# EasyEDA Pro project DreamFly.eprj, board PCB3
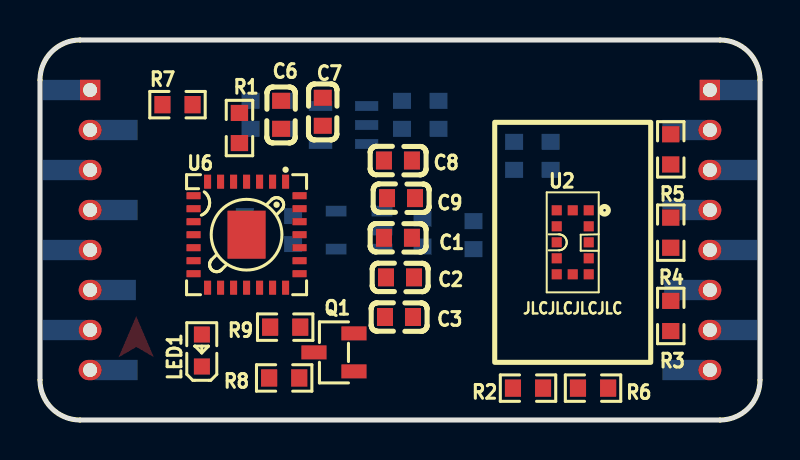
[diagram p8: board, top side]
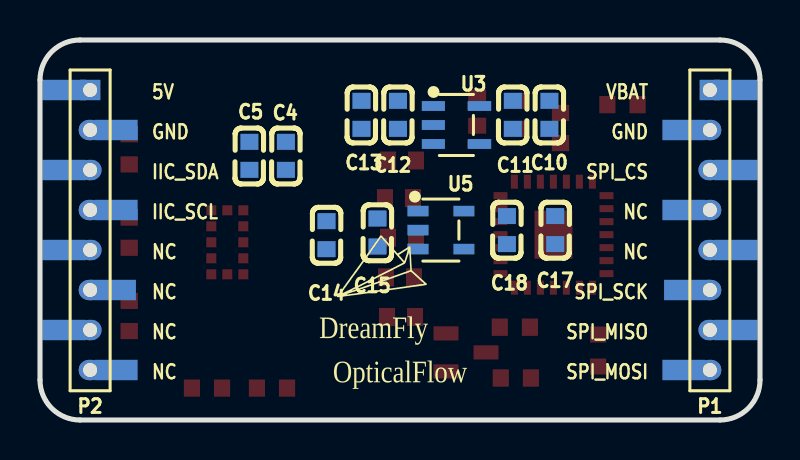
[diagram p9: board, bottom side, seen from below]

Outline 36 x 19 mm; copper layers: Top Layer, Bottom Layer. Coordinates in mm from the lower left corner of the outline.
Outline path: 0,17 0,2 arc(0.59,0.59) 2,0 34,0 arc(35.41,0.59) 36,2 36,17 arc(35.41,18.41) 34,19 2,19 arc(0.59,18.41) 0,17
Stack: Top Layer 0.035mm / Dielectric1 1.51mm FR4 er 4.5 / Bottom Layer 0.035mm

## Design rules (mm)
template: JLCPCB Capability(Two Layers Board)
spacing copperThickness1oz (default): track to track 0.102, other pairs 0.152 to 0.3
spacing copperThickness2oz: track to track 0.203, other pairs 0.152 to 0.3
track width copperThickness1oz (default): min 0.127, default 0.254, max 2.54
track width copperThickness2oz: min 0.203, default 0.254, max 2.54
differential pair differentialPair (default): width min 0.127, default 0.254, max 2.54; gap min 0.152, default 0.152
via viaSize (default): diameter min 0.5, default 0.61, max 10; hole min 0.3, default 0.305, max 6.3

## Placement (name value [footprint] x y rotation side)
C1  10uF  [C0603]  17.9 9.11 180 top
C2  10uF  [C0603]  18 7.13 180 top
C3  100nF  [C0603]  17.95 5.15 180 top
C4  10uF  [C0603]  23.7 13.21 90 bottom
C5  100nF  [C0603]  25.53 13.21 90 bottom
C6  10uF  [C0603]  12.06 15.26 90 top
C7  100nF  [C0603]  14.14 15.41 90 top
C8  10uF  [C0603]  17.9 12.97 180 top
C9  100nF  [C0603]  18.05 11.09 180 top
C10  10uF  [C0603]  10.53 15.26 90 bottom
C11  100nF  [C0603]  12.36 15.26 90 bottom
C12  10uF  [C0603]  18.1 15.26 90 bottom
C13  100nF  [C0603]  19.93 15.26 90 bottom
C14  10uF  [C0603]  21.67 9.24 90 bottom
C15  100nF  [C0603]  19.13 9.37 90 bottom
C17  10uF  [C0603]  10.24 9.5 90 bottom
C18  100nF  [C0603]  12.65 9.5 90 bottom
LED1  NCD0603W1  [LED0603-RD]  8.09 3.47 90 top
P1  -  [header10-2.0mm#2]  2.51 9.5 270 bottom
P2  -  [header10-2.0mm]  33.49 9.5 270 bottom
Q1  SS8550  [SOT-23-3_L2.9-W1.3-P1.90-LS2.4-BR]  14.7 3.38 0 top
R1  0Ω  [R0603]  9.97 14.6 270 top
R2  10Ω  [R0603]  24.4 1.59 0 top
R3  10kΩ  [R0603]  31.54 5.2 270 top
R4  4.7kΩ  [R0603]  31.54 9.37 270 top
R5  4.7kΩ  [R0603]  31.54 13.53 90 top
R6  10kΩ  [R0603]  27.65 1.59 180 top
R7  10kΩ  [R0603]  6.88 15.77 0 top
R8  2kΩ  [R0603]  12.21 2.1 0 top
R9  10R  [R0603]  12.26 4.64 0 top
U2  VL53L1CXV0FY/1  [OPTO-SMD_VL53L1CXV0FY-1]  26.64 8.88 90 top
U3  XC6204B302MR  [SOT-23-5_L3.0-W1.7-P0.95-LS2.8-BL]  15.18 14.75 270 bottom
U5  XC6204B182MR  [SOT-23-5_L3.0-W1.5-P0.95-LS2.8-BL]  15.96 9.5 270 bottom
U6  PMW3901MB  [COB-28_L6.0-W6.0-P0.65-TL-EP]  10.33 9.27 270 top

## Footprints (pads in the part's own frame, mm; a bottom-side part is the same pattern mirrored in y, then rotated)
C0603
  rect 0.8x0.9 smd: 1(-0.7,0) 2(0.7,0)
COB-28_L6.0-W6.0-P0.65-TL-EP
  rect 0.7x0.35 smd: 1(-2.65,1.95) 2(-2.65,1.3) 3(-2.65,0.65) 4(-2.65,0) 5(-2.65,-0.65) 6(-2.65,-1.3) 7(-2.65,-1.95) 15(2.65,-1.95) 16(2.65,-1.3) 17(2.65,-0.65) 18(2.65,0) 19(2.65,0.65) 20(2.65,1.3) 21(2.65,1.95)
  rect 0.35x0.7 smd: 8(-1.95,-2.65) 9(-1.3,-2.65) 10(-0.65,-2.65) 11(0,-2.65) 12(0.65,-2.65) 13(1.3,-2.65) 14(1.95,-2.65) 22(1.95,2.65) 23(1.3,2.65) 24(0.65,2.65) 25(0,2.65) 26(-0.65,2.65) 27(-1.3,2.65) 28(-1.95,2.65)
  rect 2.4x1.9 smd: 29(0,0)
header10-2.0mm
  rect 1.016x2.159 smd: 1(-7,-1.297) 2(-5,1.297) 3(-2.999,-1.297) 4(-1,1.297) 5(1,-1.297) 7(5,-1.297) 8(7,1.297)
  rect 1.016x1.016 hole 0.7: 1(-7,0)
  oval 1.016x1.143 hole 0.7: 2(-5,0) 3(-2.999,0) 4(-1,0) 5(1,0) 6(3.001,0) 7(5,0) 8(7,0)
  rect 1.016x2.286 smd: 6(3.001,1.145)
header10-2.0mm#2
  rect 1.016x1.016 hole 0.7: 1(-7,0)
  rect 1.016x2.159 smd: 1(-7,1.297) 2(-5,-1.297) 3(-2.999,1.297) 4(-1,-1.297) 5(1,1.297) 7(5,1.297) 8(7,-1.297)
  oval 1.016x1.143 hole 0.7: 2(-5,0) 3(-2.999,0) 4(-1,0) 5(1,0) 6(3.001,0) 7(5,0) 8(7,0)
  rect 1.016x2.286 smd: 6(3.001,-1.145)
LED0603-RD
  rect 0.8x0.8 smd: 1(-0.799,0) 2(0.799,0)
OPTO-SMD_VL53L1CXV0FY-1
  rect 0.5x0.5 smd: 1(1.6,-0.8) 2(0.8,-0.8) 3(0,-0.8) 4(-0.8,-0.8) 5(-1.6,-0.8) 6(-1.6,0) 7(-1.6,0.8) 8(-0.8,0.8) 9(0,0.8) 10(0.8,0.8) 11(1.6,0.8) 12(1.6,0)
R0603
  rect 0.806x0.864 smd: 1(-0.753,0) 2(0.753,0)
SOT-23-3_L2.9-W1.3-P1.90-LS2.4-BR
  rect 1.25x0.7 smd: 1(1,-0.95) 2(1,0.95) 3(-1,0)
SOT-23-5_L3.0-W1.5-P0.95-LS2.8-BL
  rect 0.532x1.045 smd: 1(-0.95,-1.147) 2(0,-1.147) 3(0.95,-1.147) 4(0.95,1.147) 5(-0.95,1.147)
SOT-23-5_L3.0-W1.7-P0.95-LS2.8-BL
  rect 0.49x1.157 smd: 1(-0.95,-1.153) 2(0,-1.153) 3(0.95,-1.153)
  rect 0.49x1.175 smd: 4(0.95,1.153) 5(-0.95,1.153)

## Nets
As in the schematic.

Pads without a net: P1 4 5; P2 1 5 6 7 8; U2 8; U3 4; U5 4; U6 5 6 8 9 10 11 12 13 14 15 22 23 24 25 26 27 28

## Copper pours and planes (outline as drawn; the poured copper is in the pictures)
(no net) on Top Layer: 3.93,5.19 5.69,5.19 5.69,3.13 3.93,3.13

## Text on the board
Bottom Silkscreen Layer: 5V | GND | IIC_SDA | IIC_SCL | NC | VBAT | SPI_CS | SPI_SCK | SPI_MISO | SPI_MOSI | OpticalFlow | DreamFly
Top Silkscreen Layer: JLCJLCJLCJLC
